# EAGLE design eurorack-passive-multiple (EAGLE 9.6.2)
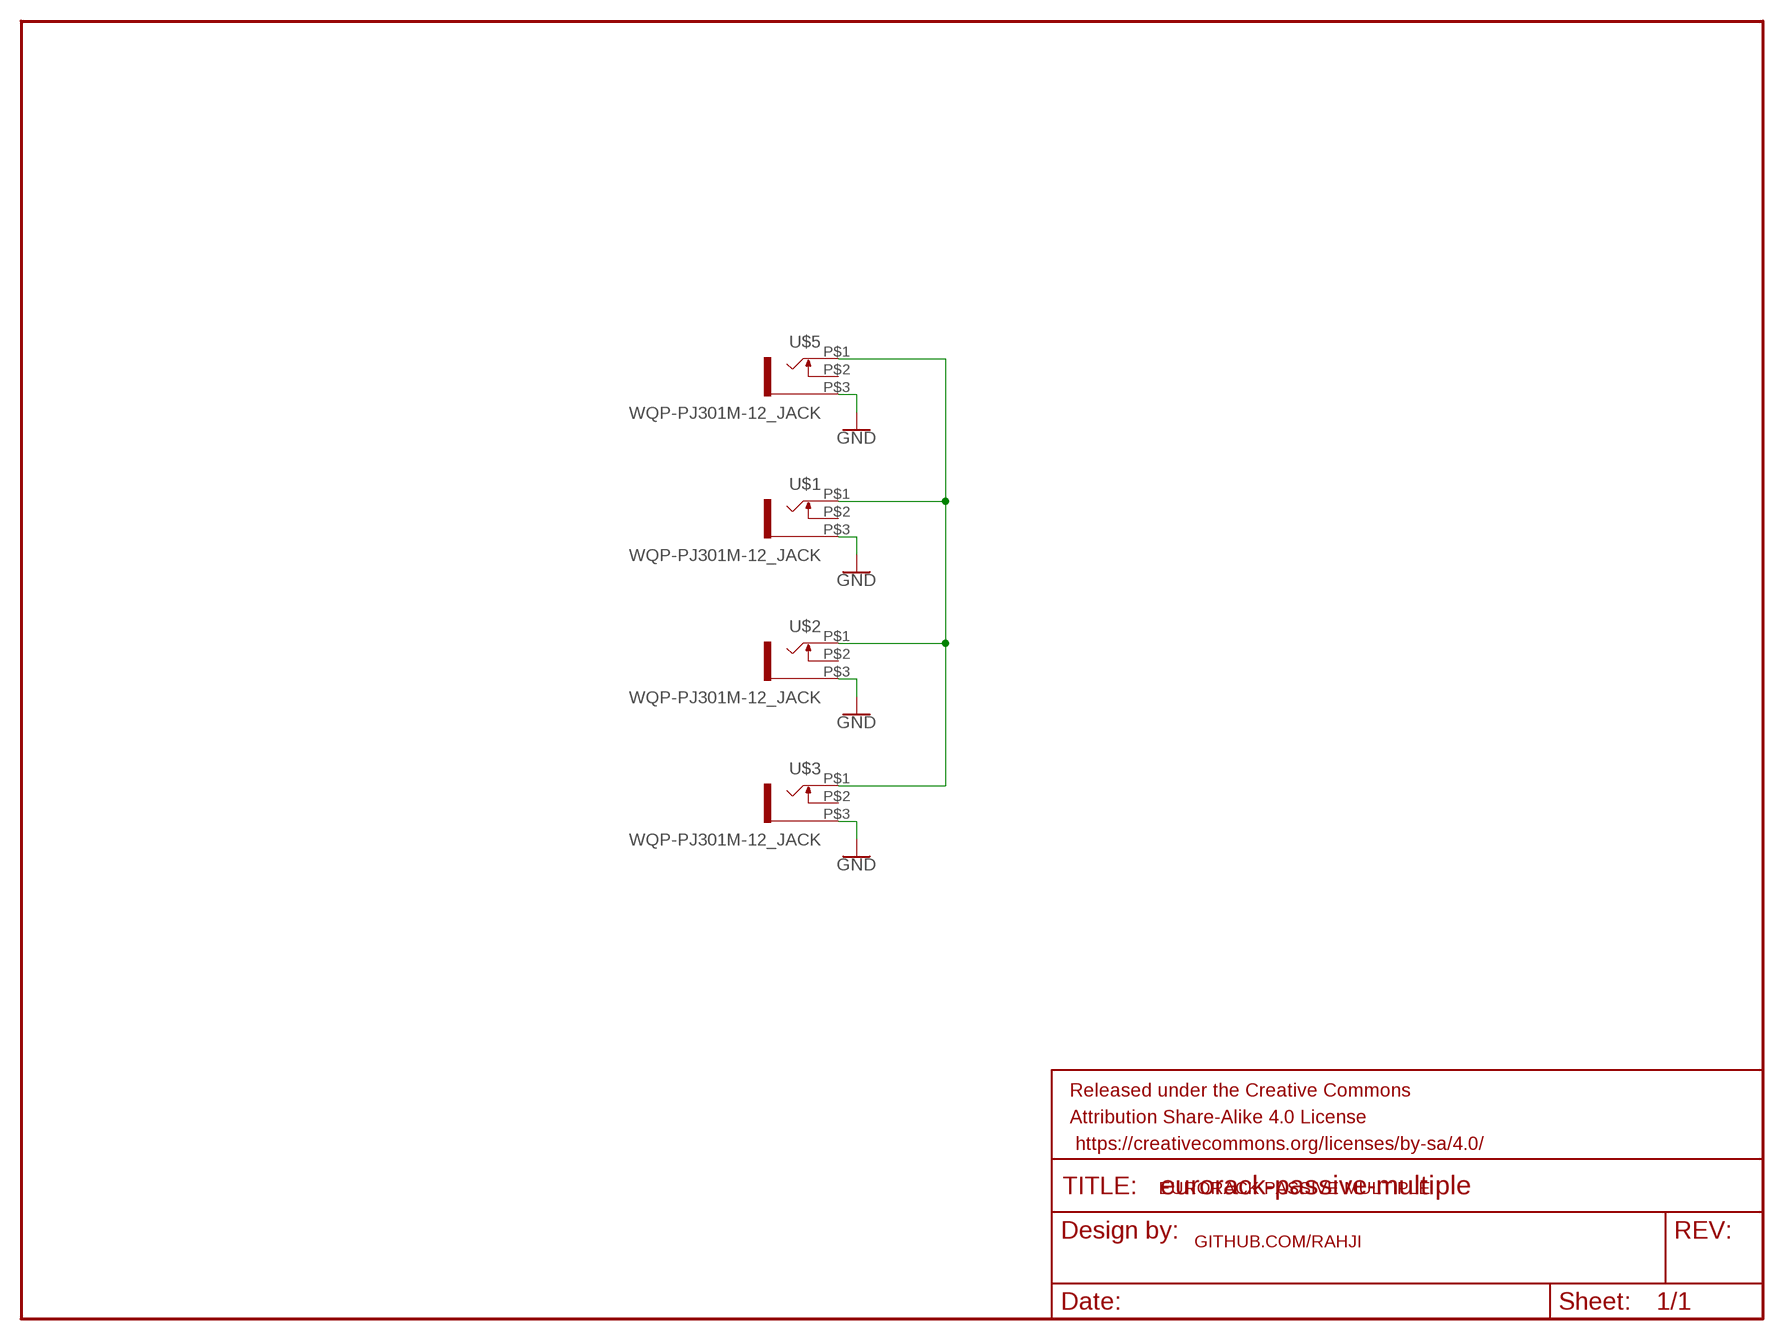
[diagram p0: schematic, sheet 1]

## Parts
FRAME1  FRAME-LETTERNO_PACKAGE  [DUMMY]
U$1  WQP-PJ301M-12_JACK  [WQP-PJ301M-12_JACK]
U$2  WQP-PJ301M-12_JACK  [WQP-PJ301M-12_JACK]
U$3  WQP-PJ301M-12_JACK  [WQP-PJ301M-12_JACK]
U$5  WQP-PJ301M-12_JACK  [WQP-PJ301M-12_JACK]

## Nets
GND: U$1.P$3 U$2.P$3 U$3.P$3 U$5.P$3
N$1: U$1.P$1 U$2.P$1 U$3.P$1 U$5.P$1
Unconnected: U$1.P$2 U$2.P$2 U$3.P$2 U$5.P$2

## Notes on the sheet
- EURORACK PASSIVE MULTIPLE
- GITHUB.COM/RAHJI

## Library data of the parts
FRAME1 = SparkFun-Aesthetics:FRAME-LETTER: Schematic Frame - Letter Standard 8.5x11 US Letter frame; DESIGNER: Nobody; VERSION: v01
U$1-U$3 U$5 = thonkiconn:WQP-PJ301M-12_JACK

## Board
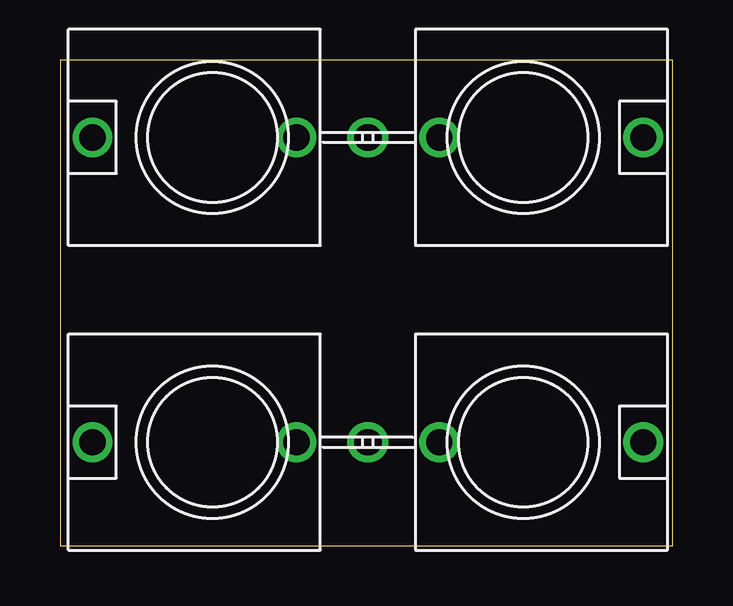
[diagram p1: board, top side]
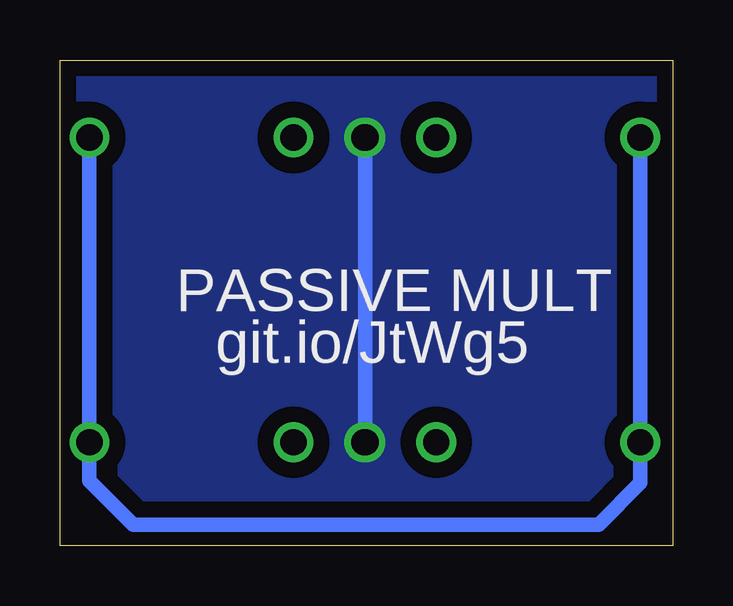
[diagram p2: board, bottom side, seen from below]

Size 25.53 x 20.24 mm. Coordinates in mm from the lower left corner, seen from the top.
Outline: 0,0 25.53,0 25.53,20.24 0,20.24 0,0
Copper layers (1*16): Top 0.0356mm / dielectric 1.5011mm / Bottom 0.0356mm
Design rules "oshpark-2layer": minimum track width 6mil, minimum drill 13mil, track to track 6mil, track to pad 6mil, pad to pad 6mil, via to via 6mil, smd to smd 6mil, copper to edge 15mil, drill to drill 6mil, minimum pad ring 7mil, minimum via ring 7mil, stop-mask expansion 2.5mil, vias tented up to drill 0mil, thermal gap 10mil

### Footprints (pad centres in the part's own frame; a part is rotated, then mirrored left to right if it is on the bottom)
WQP-PJ301M-12_JACK = drill 1.1: P$1 0,5; P$2 0,-3.5; P$3 0,-6.5

### Placement (x,y rotation side)
FRAME1  -5.08,-3.81 0 top  (outside the outline)
U$1  6.35,4.32 90 top
U$2  6.35,17.02 90 top
U$3  19.3,17.02 270 top
U$5  19.3,4.32 270 top

### Tracks (layer width: path | path; a pad name or v marks a point on that pad's centre or on a via)
GND
  Bottom 0.61: U$3.P$3 12.8,4.36 U$1.P$3
  pour Bottom (isolate 0.66, no thermals): -1.14,21.59 26.8,21.59 26.8,-1.27 -1.14,-1.27
N$1
  Bottom 0.61: U$2.P$1 U$1.P$1 1.35,2.62 3.08,0.89 22.48,0.89 24.3,2.71 U$5.P$1 U$3.P$1

### Text on the board
bPlace: PASSIVE MULT | git.io/JtWg5